# Altium schematic sheet BMS_PowerManagement.SchDoc
size A
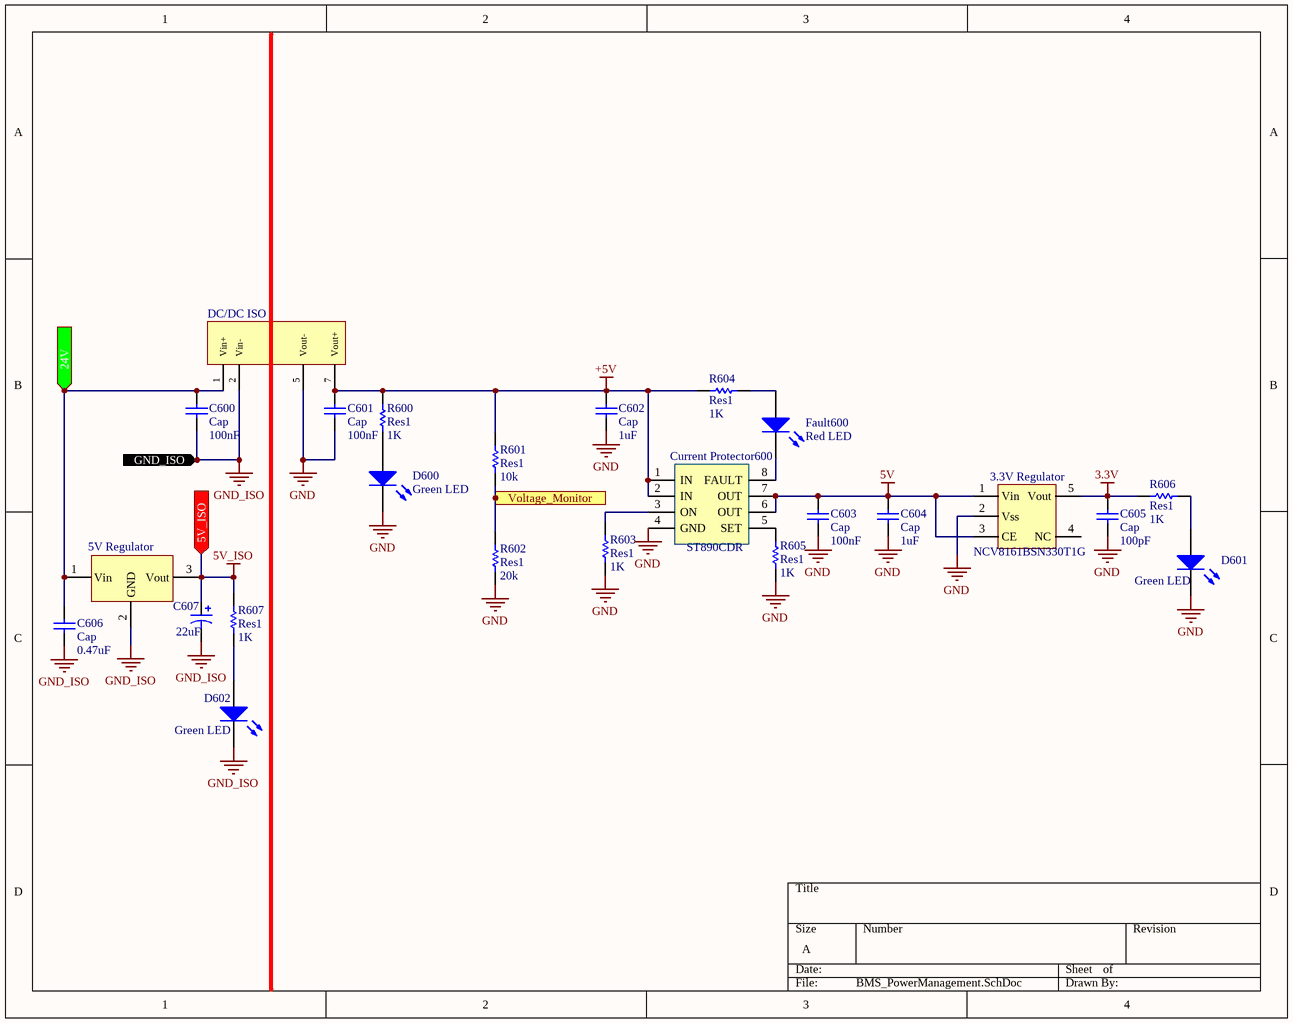
[diagram p0: BMS_PowerManagement.SchDoc]

## Parts
3.3V_Regulator  NCV8161BSN330T1G  [SOT95P280X110-5N]
5V_Regulator  LM2940IMPX-5.0/NOPB  [SOT230P700X180-4N]  (value not drawn)
C600  Cap  value 100nF  [CAPC2012X14N]
C601  Cap  value 100nF  [CAPC2012X14N]
C602  Cap  value 1uF  [CAPC2012X14N]
C603  Cap  value 100nF  [CAPC2012X14N]
C604  Cap  value 1uF  [CAPC2012X14N]
C605  Cap  value 100pF  [CAPC2012X14N]
C606  Cap  value 0.47uF  [CAPC2012X14N]
C607  value 22uF  [TPSA226K006T0300 Capacitor]  (hidden comment: Cap Pol1)
Current_Protector600  ST890CDR  [SOIC127P600X175-8N]
D600  Green LED  [SMD GREEN LED]
D601  Green LED  [SMD GREEN LED]
D602  Green LED  [SMD GREEN LED]
DC/DC_ISO  Isolated 5V DC/DC  [Isolated DC/DC]  (value not drawn)
Fault600  Red LED  [SMD RED LED]
R600  Res1  value 1K  [RESC2012X07N]
R601  Res1  value 10k  [RESC2012X07N]
R602  Res1  value 20k  [RESC2012X07N]
R603  Res1  value 1K  [RESC2012X07N]
R604  Res1  value 1K  [RESC2012X07N]
R605  Res1  value 1K  [RESC2012X07N]
R606  Res1  value 1K  [RESC2012X07N]
R607  Res1  value 1K  [RESC2012X07N]

## Ports
5V_ISO (in), 24V (in), GND_ISO (in), Voltage_Monitor (out)

## Nets
3.3V: 3.3V_Regulator.5(Vout) C605.1 R606.2
5V: 3.3V_Regulator.1(Vin) 3.3V_Regulator.3(CE) C603.1 C604.2 Current_Protector600.6(OUT) Current_Protector600.7(OUT)
5V_ISO: 5V_Regulator.3(Vout) C607.1 R607.2 ; port 5V_ISO
+5V: C601.1 C602.2 Current_Protector600.1(IN) Current_Protector600.2(IN) DC/DC_ISO.7(Vout+) R600.2 R601.2 R604.2
GND: 3.3V_Regulator.2(Vss) C601.2 C602.1 C603.2 C604.1 C605.2 Current_Protector600.4(GND) D600.2(K) D601.2(K) DC/DC_ISO.5(Vout-) R602.1 R603.1 R605.1
GND_ISO: 5V_Regulator.2(GND) C600.2 C606.2 C607.2 D602.2(K) DC/DC_ISO.2(Vin-) ; port GND_ISO
24V: 5V_Regulator.1(Vin) C600.1 C606.1 DC/DC_ISO.1(Vin+) ; port 24V
Voltage_Monitor: R601.1 R602.2 ; port Voltage_Monitor
NetCurrent_Protector600_3: Current_Protector600.3(ON) R603.2
NetCurrent_Protector600_5: Current_Protector600.5(SET) R605.2
NetCurrent_Protector600_8: Current_Protector600.8(FAULT) Fault600.2(K)
NetD600_1: D600.1(A) R600.1
NetD601_1: D601.1(A) R606.1
NetD602_1: D602.1(A) R607.1
NetFault600_1: Fault600.1(A) R604.1

Not connected (* = marked no-connect by the designer): 3.3V_Regulator 4(NC)

## Library data of the parts
3.3V_Regulator = NCV8161BSN330T1G: 450 mA, Ultra-Low Noise  and High PSRR LDO  Regulator for RF and  Analog Circuits
5V_Regulator = LM2940IMPX-5.0/NOPB: LM2940x 1-A Low Dropout Regulator
C600-C606 = Cap: Capacitor; Published: 8-Jun-2000; LatestRevisionDate: 17-Jul-2002; LatestRevisionNote: Re-released for DXP Platform.; PackageReference: RAD-0.3; Publisher: Altium Limited; PackageDescription: Radial Cap, Thru-Hole; 2 Leads; 0.3 in Pin Spacing
C607 = Cap Pol1: TPSA226K006T0300; Published: 8-Jun-2000; LatestRevisionDate: 17-Jul-2002; LatestRevisionNote: Re-released for DXP Platform.; PackageReference: RB7.6-15; Publisher: Altium Limited; PackageDescription: Polarized Capacitor (Radial); 2 Leads
Current_Protector600 = ST890CDR: 1.2A Current Limited High-Side Power Switch with Thermal Shutdown
D600-D602 Fault600 = LED0: Typical INFRARED GaAs LED; Published: 8-Jun-2000; LatestRevisionDate: 08-Jul-2005; LatestRevisionNote: Mech Layer 1 removed.; PackageReference: LED-0; Publisher: Altium Limited; PackageDescription: LED; 2 Leads
DC/DC_ISO = Isolated DC/DC: RKZE-0505S/H Isolated DC/DC Converters 2W 05Vin 5Vout 400mA Single SIP7
R600-R607 = Res1: Resistor; Published: 8-Jun-2000; LatestRevisionDate: 17-Jul-2002; LatestRevisionNote: Re-released for DXP Platform.; PackageReference: AXIAL-0.3; Publisher: Altium Limited; PackageDescription: Axial Device, Thru-Hole; 2 Leads; 0.3 in Pin Spacing